# Altium schematic sheet interfaces_nucleo.SchDoc
size A3
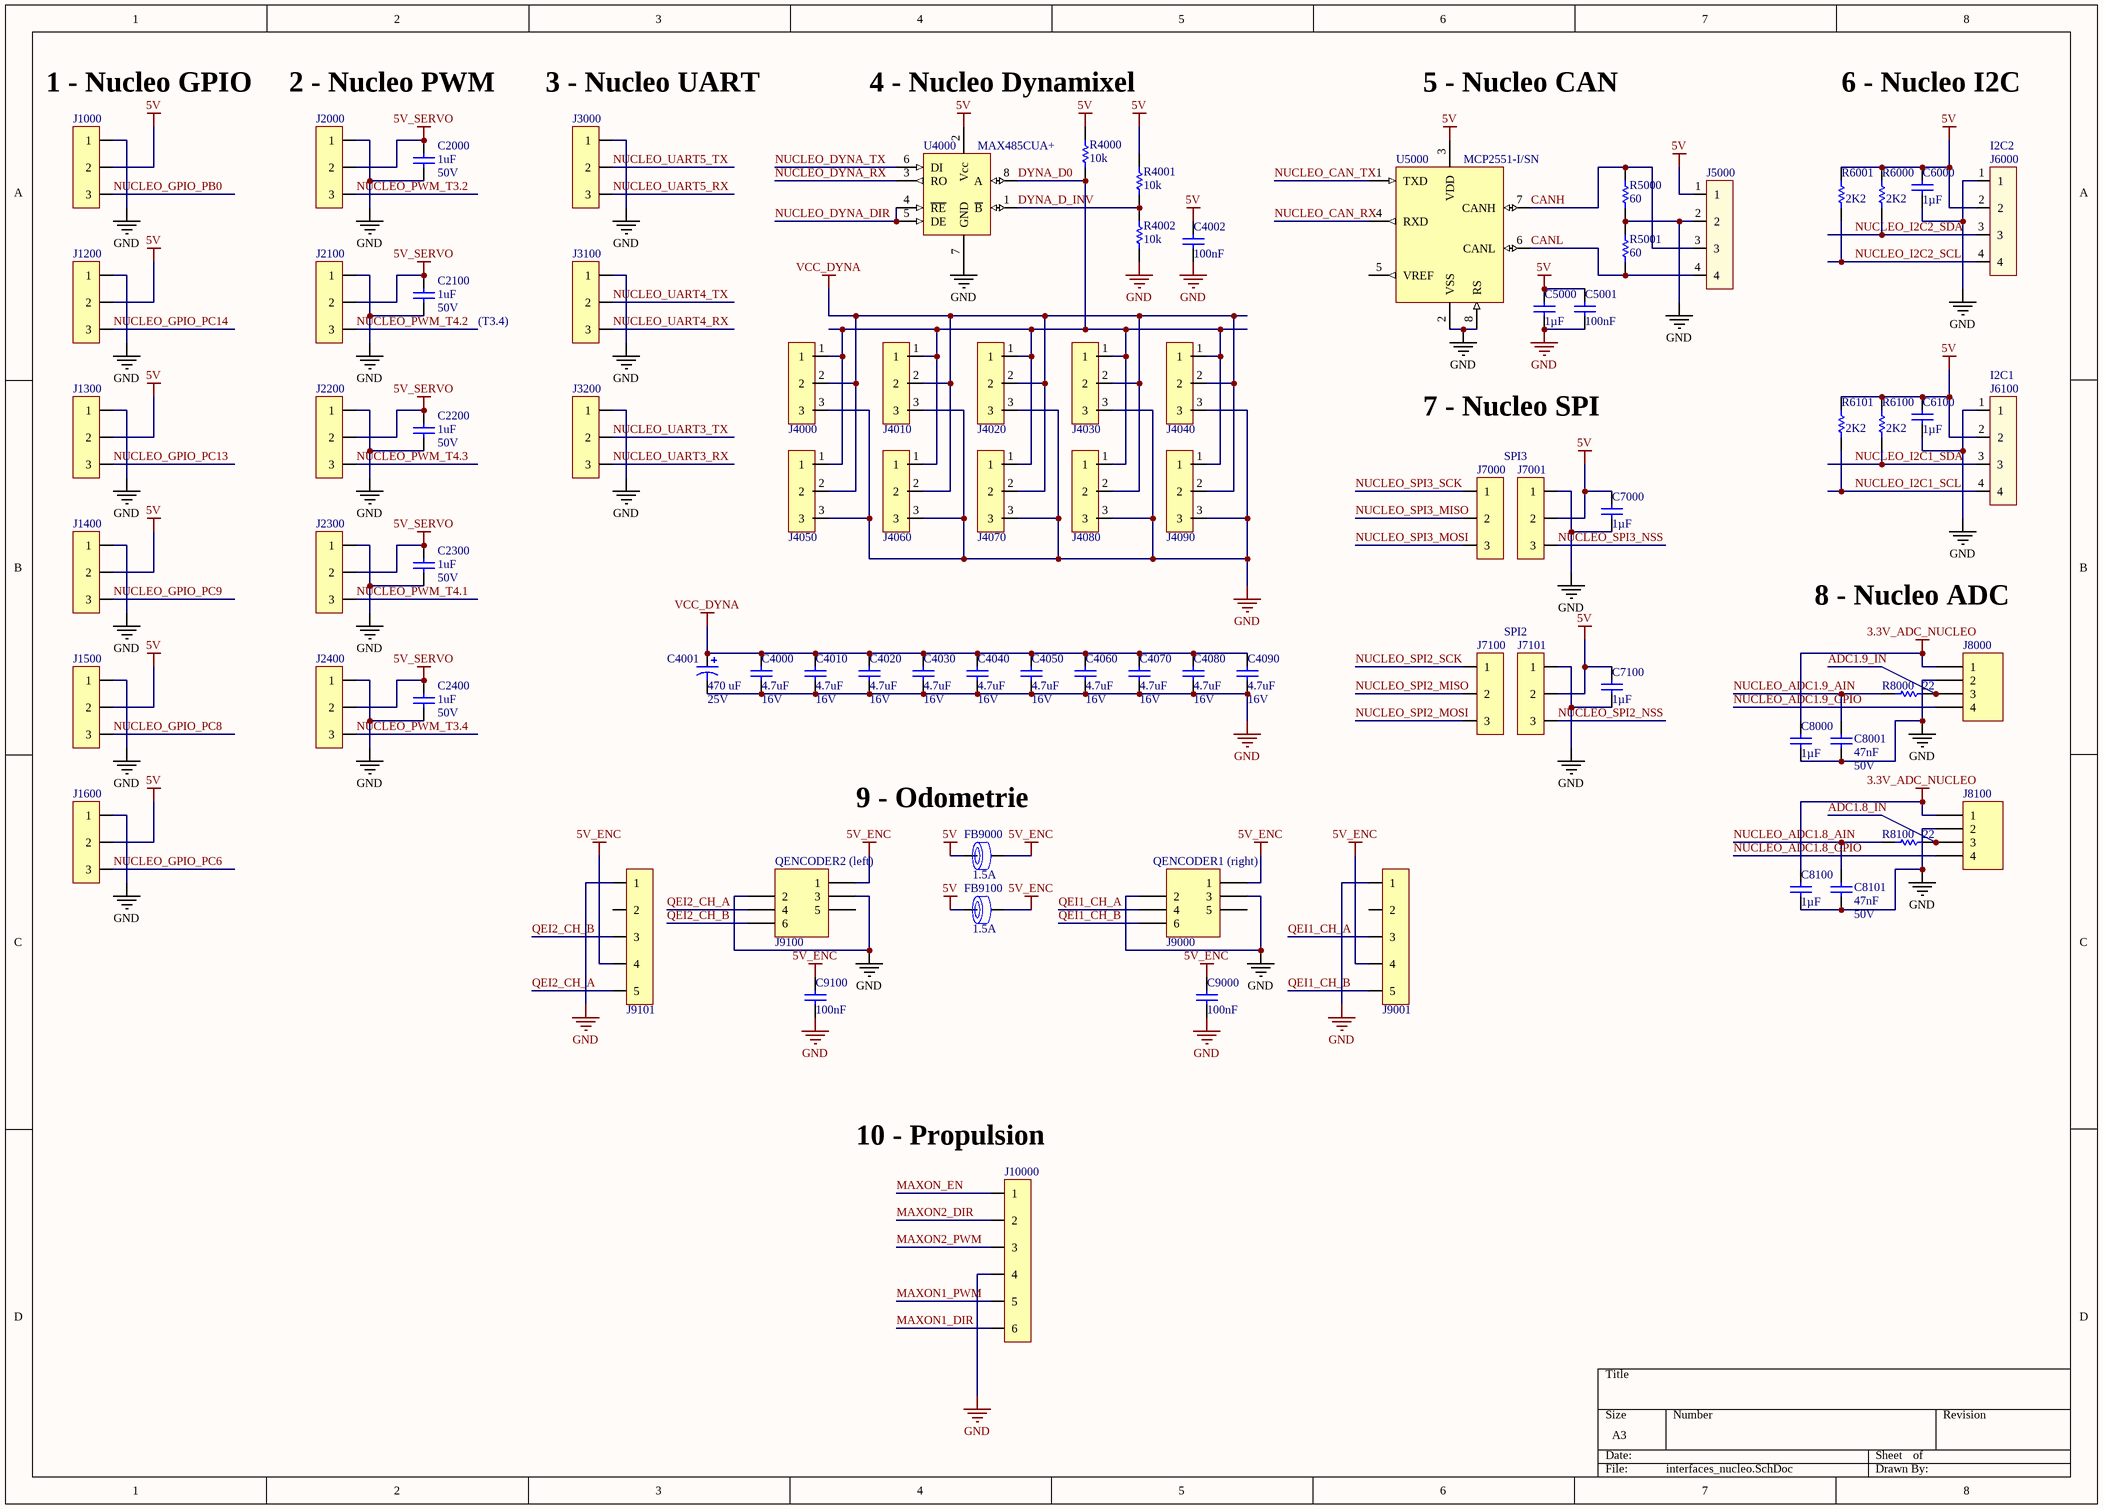
[diagram p0: interfaces_nucleo.SchDoc]

## Parts
C2000  1uF  RatedVoltage: 50V  [WCAP-CSGP_0805, 2x1.25x1.25]
C2100  1uF  RatedVoltage: 50V  [WCAP-CSGP_0805, 2x1.25x1.25]
C2200  1uF  RatedVoltage: 50V  [WCAP-CSGP_0805, 2x1.25x1.25]
C2300  1uF  RatedVoltage: 50V  [WCAP-CSGP_0805, 2x1.25x1.25]
C2400  1uF  RatedVoltage: 50V  [WCAP-CSGP_0805, 2x1.25x1.25]
C4000  4.7uF  RatedVoltage: 16V  [WCAP-CSGP_0805, 2x1.25x1.25]
C4001  470 uF  RatedVoltage: 25V  [WCAP-ATG8_8x11.5x3.5x0.5]
C4002  100nF  [WCAP-CSGP_0603, 1.6x0.8x0.8]
C4010  4.7uF  RatedVoltage: 16V  [WCAP-CSGP_0805, 2x1.25x1.25]
C4020  4.7uF  RatedVoltage: 16V  [WCAP-CSGP_0805, 2x1.25x1.25]
C4030  4.7uF  RatedVoltage: 16V  [WCAP-CSGP_0805, 2x1.25x1.25]
C4040  4.7uF  RatedVoltage: 16V  [WCAP-CSGP_0805, 2x1.25x1.25]
C4050  4.7uF  RatedVoltage: 16V  [WCAP-CSGP_0805, 2x1.25x1.25]
C4060  4.7uF  RatedVoltage: 16V  [WCAP-CSGP_0805, 2x1.25x1.25]
C4070  4.7uF  RatedVoltage: 16V  [WCAP-CSGP_0805, 2x1.25x1.25]
C4080  4.7uF  RatedVoltage: 16V  [WCAP-CSGP_0805, 2x1.25x1.25]
C4090  4.7uF  RatedVoltage: 16V  [WCAP-CSGP_0805, 2x1.25x1.25]
C5000  1µF  [WCAP-CSGP_0603, 1.6x0.8x0.8]
C5001  100nF  [WCAP-CSGP_0603, 1.6x0.8x0.8]
C6000  1µF  [WCAP-CSGP_0603, 1.6x0.8x0.8]
C6100  1µF  [WCAP-CSGP_0603, 1.6x0.8x0.8]
C7000  1µF  [WCAP-CSGP_0603, 1.6x0.8x0.8]
C7100  1µF  [WCAP-CSGP_0603, 1.6x0.8x0.8]
C8000  1µF  [WCAP-CSGP_0603, 1.6x0.8x0.8]
C8001  47nF  RatedVoltage: 50V  [WCAP-CSGP_0603, 1.6x0.8x0.8]
C8100  1µF  [WCAP-CSGP_0603, 1.6x0.8x0.8]
C8101  47nF  RatedVoltage: 50V  [WCAP-CSGP_0603, 1.6x0.8x0.8]
C9000  100nF  [WCAP-CSGP_0603, 1.6x0.8x0.8]
C9100  100nF  [WCAP-CSGP_0603, 1.6x0.8x0.8]
FB9000  RatedCurrent: 1.5A  [WE-CBF_0603_High Current]  (hidden comment: 742792624)
FB9100  RatedCurrent: 1.5A  [WE-CBF_0603_High Current]  (hidden comment: 742792624)
J1000  22-03-2031  [22-03-2031]  (value not drawn)
J1200  22-03-2031  [22-03-2031]  (value not drawn)
J1300  22-03-2031  [22-03-2031]  (value not drawn)
J1400  22-03-2031  [22-03-2031]  (value not drawn)
J1500  22-03-2031  [22-03-2031]  (value not drawn)
J1600  22-03-2031  [22-03-2031]  (value not drawn)
J2000  22-03-2031  [22-03-2031]  (value not drawn)
J2100  22-03-2031  [22-03-2031]  (value not drawn)
J2200  22-03-2031  [22-03-2031]  (value not drawn)
J2300  22-03-2031  [22-03-2031]  (value not drawn)
J2400  22-03-2031  [22-03-2031]  (value not drawn)
J3000  22-03-2031  [22-03-2031]  (value not drawn)
J3100  22-03-2031  [22-03-2031]  (value not drawn)
J3200  22-03-2031  [22-03-2031]  (value not drawn)
J4000  22-03-5035  [20-03-5035]  (value not drawn)
J4010  22-03-5035  [20-03-5035]  (value not drawn)
J4020  22-03-5035  [20-03-5035]  (value not drawn)
J4030  22-03-5035  [20-03-5035]  (value not drawn)
J4040  22-03-5035  [20-03-5035]  (value not drawn)
J4050  22-03-5035  [20-03-5035]  (value not drawn)
J4060  22-03-5035  [20-03-5035]  (value not drawn)
J4070  22-03-5035  [20-03-5035]  (value not drawn)
J4080  22-03-5035  [20-03-5035]  (value not drawn)
J4090  22-03-5035  [20-03-5035]  (value not drawn)
J5000  22-27-2041  [22-27-2041]  (value not drawn)
J6000  22-27-2041  [22-27-2041]  (value not drawn)
J6100  22-27-2041  [22-27-2041]  (value not drawn)
J7000  22-03-2031  [22-03-2031]  (value not drawn)
J7001  22-03-2031  [22-03-2031]  (value not drawn)
J7100  22-03-2031  [22-03-2031]  (value not drawn)
J7101  22-03-2031  [22-03-2031]  (value not drawn)
J8000  MC34645  [HDR1X4]  (value not drawn)
J8100  MC34645  [HDR1X4]  (value not drawn)
J9000  (no value)  [690367280676]
J9001  22-03-2051  [22-03-2051]  (value not drawn)
J9100  (no value)  [690367280676]
J9101  22-03-2051  [22-03-2051]  (value not drawn)
J10000  22-03-2061  [22-03-2061]  (value not drawn)
R4000  value 10k  [RESC1005X04N]  (hidden comment: RC0402FR-07100RL)
R4001  value 10k  [RESC1005X04N]  (hidden comment: RC0402FR-07100RL)
R4002  value 10k  [RESC1005X04N]  (hidden comment: RC0402FR-07100RL)
R5000  value 60  [RESC1005X04N]  (hidden comment: RC0402FR-07100RL)
R5001  value 60  [RESC1005X04N]  (hidden comment: RC0402FR-07100RL)
R6000  value 2K2  [RESC1005X04N]  (hidden comment: RC0402FR-07100RL)
R6001  value 2K2  [RESC1005X04N]  (hidden comment: RC0402FR-07100RL)
R6100  value 2K2  [RESC1005X04N]  (hidden comment: RC0402FR-07100RL)
R6101  value 2K2  [RESC1005X04N]  (hidden comment: RC0402FR-07100RL)
R8000  value 22  [RESC1005X04N]  (hidden comment: RC0402FR-0722RL)
R8100  value 22  [RESC1005X04N]  (hidden comment: RC0402FR-0722RL)
U4000  MAX485CUA+  [MMAX-8]
U5000  MCP2551-I/SN  [SO8_N]

## Nets
3.3V_ADC_NUCLEO: C8000.1 C8100.1 J8000.1 J8100.1
5V: C4002.1 C5000.1 C5001.1 C6000.1 C6100.1 C7000.1 C7100.1 FB9000.1 FB9100.1 J1000.2 J1200.2 J1300.2 J1400.2 J1500.2 J1600.2 J5000.1 J6000.2 J6100.2 J7001.2 J7101.2 R4000.2 R4001.2 R6000.2 R6001.2 R6100.2 R6101.2 U4000.2(Vcc) U5000.3(VDD)
5V_ENC: C9000.1 C9100.1 FB9000.2 FB9100.2 J9000.1 J9001.4 J9100.1 J9101.4
5V_SERVO: C2000.2 C2100.2 C2200.2 C2300.2 C2400.2 J2000.2 J2100.2 J2200.2 J2300.2 J2400.2
GND: C2000.1 C2100.1 C2200.1 C2300.1 C2400.1 C4000.1 C4001.2 C4002.2 C4010.1 C4020.1 C4030.1 C4040.1 C4050.1 C4060.1 C4070.1 C4080.1 C4090.1 C5000.2 C5001.2 C6000.2 C6100.2 C7000.2 C7100.2 C8000.2 C8001.1 C8100.2 C8101.1 C9000.2 C9100.2 J1000.1 J1200.1 J1300.1 J1400.1 J1500.1 J1600.1 J2000.1 J2100.1 J2200.1 J2300.1 J2400.1 J3000.1 J3100.1 J3200.1 J4000.3 J4010.3 J4020.3 J4030.3 J4040.3 J4050.3 J4060.3 J4070.3 J4080.3 J4090.3 J5000.2 J6000.1 J6100.1 J7001.1 J7101.1 J8000.2 J8100.2 J9000.2 J9000.3 J9001.1 J9100.2 J9100.3 J9101.1 J10000.4 R4002.1 R5000.1 R5001.2 U4000.7(GND) U5000.2(VSS) U5000.8(RS)
VCC_DYNA: C4000.2 C4001.1 C4010.2 C4020.2 C4030.2 C4040.2 C4050.2 C4060.2 C4070.2 C4080.2 C4090.2 J4000.2 J4010.2 J4020.2 J4030.2 J4040.2 J4050.2 J4060.2 J4070.2 J4080.2 J4090.2
ADC1.8_IN: J8100.3 R8100.2
ADC1.9_IN: J8000.3 R8000.2
CANH: J5000.3 R5000.2 U5000.7(CANH)
CANL: J5000.4 R5001.1 U5000.6(CANL)
DYNA_D0: J4000.1 J4010.1 J4020.1 J4030.1 J4040.1 J4050.1 J4060.1 J4070.1 J4080.1 J4090.1 R4000.1 U4000.8(A)
DYNA_D_INV: R4001.1 R4002.2 U4000.1(~{B})
MAXON1_DIR: J10000.6
MAXON1_PWM: J10000.5
MAXON2_DIR: J10000.2
MAXON2_PWM: J10000.3
MAXON_EN: J10000.1
NUCLEO_ADC1.8_AIN: C8101.2 R8100.1
NUCLEO_ADC1.8_GPIO: J8100.4
NUCLEO_ADC1.9_AIN: C8001.2 R8000.1
NUCLEO_ADC1.9_GPIO: J8000.4
NUCLEO_CAN_RX: U5000.4(RXD)
NUCLEO_CAN_TX: U5000.1(TXD)
NUCLEO_DYNA_DIR: U4000.4(~{RE}) U4000.5(DE)
NUCLEO_DYNA_RX: U4000.3(RO)
NUCLEO_DYNA_TX: U4000.6(DI)
NUCLEO_GPIO_PB0: J1000.3
NUCLEO_GPIO_PC6: J1600.3
NUCLEO_GPIO_PC8: J1500.3
NUCLEO_GPIO_PC9: J1400.3
NUCLEO_GPIO_PC13: J1300.3
NUCLEO_GPIO_PC14: J1200.3
NUCLEO_I2C1_SCL: J6100.4 R6101.1
NUCLEO_I2C1_SDA: J6100.3 R6100.1
NUCLEO_I2C2_SCL: J6000.4 R6001.1
NUCLEO_I2C2_SDA: J6000.3 R6000.1
NUCLEO_PWM_T3.2: J2000.3
NUCLEO_PWM_T3.4: J2400.3
NUCLEO_PWM_T4.1: J2300.3
NUCLEO_PWM_T4.2: J2100.3
NUCLEO_PWM_T4.3: J2200.3
NUCLEO_SPI2_MISO: J7100.2
NUCLEO_SPI2_MOSI: J7100.3
NUCLEO_SPI2_NSS: J7101.3
NUCLEO_SPI2_SCK: J7100.1
NUCLEO_SPI3_MISO: J7000.2
NUCLEO_SPI3_MOSI: J7000.3
NUCLEO_SPI3_NSS: J7001.3
NUCLEO_SPI3_SCK: J7000.1
NUCLEO_UART3_RX: J3200.3
NUCLEO_UART3_TX: J3200.2
NUCLEO_UART4_RX: J3100.3
NUCLEO_UART4_TX: J3100.2
NUCLEO_UART5_RX: J3000.3
NUCLEO_UART5_TX: J3000.2
QEI1_CH_A: J9000.4 J9001.3
QEI1_CH_B: J9000.6 J9001.5
QEI2_CH_A: J9100.4 J9101.5
QEI2_CH_B: J9100.6 J9101.3

Not connected (* = marked no-connect by the designer): J9000 5; J9001 2; J9100 5; J9101 2; U5000 5(VREF)

## Notes on the sheet
- (near J1000) 1 - Nucleo GPIO
- 2 - Nucleo PWM
- (near J3000) 3 - Nucleo UART
- 4 - Nucleo Dynamixel
- 5 - Nucleo CAN
- 6 - Nucleo I2C
- (near J6000) I2C2
- (T3.4)
- (near J6100) I2C1
- 7 - Nucleo SPI
- SPI3
- SPI2
- 8 - Nucleo ADC
- (near FB9000) 9 - Odometrie
- (near J9100) QENCODER2 (left)
- (near J9000) QENCODER1 (right)
- (near J10000) 10 - Propulsion

## Library data of the parts
C2000 C2100 C2200 C2300 C2400 = WCAP-CSGP, 885012207103: CAP CER 1uF 50V X7R 0805; Manufacturer: Wurth Elektronik; PublishedDate: Aug 2016; ComponentLink1Description: Manufacturer; ComponentLink1URL: http://www.we-online.de; ComponentLink2Description: Datasheet; ComponentLink2URL: http://katalog.we-online.com/pbs/datasheet/885012207103.pdf; Manufacturer Part Number: 885012207103; Value: 1uF; Size: 0805; CeramicType: X7R; ComponentClass: 2_NUCLEO_PWM
C4000 C4010 C4020 C4030 C4040 C4050 C4060 C4070 C4080 C4090 = WCAP-CSGP, 885012207053: CAP CER 4.7uF 16V X7R 0805; Manufacturer: Wurth Elektronik; PublishedDate: Aug 2016; ComponentLink1Description: Manufacturer; ComponentLink1URL: http://www.we-online.de; ComponentLink2Description: Datasheet; ComponentLink2URL: http://katalog.we-online.com/pbs/datasheet/885012207053.pdf; Manufacturer Part Number: 885012207053; Value: 4.7uF; Size: 0805; CeramicType: X7R; ComponentClass: 4_NUCLEO_DYNA
C4001 = WCAP-ATG8, 860010474013: CAP Alu 470 UF 20% 25 V; Manufacturer: Wurth Elektronik; PublishedDate: July 2016; ComponentLink1Description: Manufacturer; ComponentLink1URL: http://www.we-online.de; ComponentLink2Description: Datasheet; ComponentLink2URL: http://katalog.we-online.de/pbs/datasheet/860010474013.pdf; Manufacturer Part Number: 860010474013; Value: 470 uF; Size: 8mmx11.5mm; ComponentClass: 4_NUCLEO_DYNA
C4002 C5000 C5001 C6000 C6100 C7000 C7100 C8000 C8100 C9000 C9100 = WCAP-CSGP, 885012206095: CAP CER 100nF 50V X7R 0603; Manufacturer: Wurth Elektronik; PublishedDate: Aug 2016; ComponentLink1Description: Manufacturer; ComponentLink1URL: http://www.we-online.de; ComponentLink2Description: Datasheet; ComponentLink2URL: http://katalog.we-online.com/pbs/datasheet/885012206095.pdf; Manufacturer Part Number: 885012206095; Value: 100nF; Size: 0603; CeramicType: X7R; RatedVoltage: 50V
  C4002: ComponentClass: 4_NUCLEO_DYNA
  C5000 C5001: ComponentClass: 5_NUCLEO_CAN
  C6000 C6100: ComponentClass: 6_NUCLEO_I2C
  C7000 C7100: ComponentClass: 7_NUCLEO_SPI
  C8000 C8100: ComponentClass: 8_NUCLEO_ADC
  C9000 C9100: ComponentClass: 9_NUCLEO_ODO
C8001 C8101 = WCAP-CSGP, 885012206093: CAP CER 47nF 50V X7R 0603; Manufacturer: Wurth Elektronik; PublishedDate: Aug 2016; ComponentLink1Description: Manufacturer; ComponentLink1URL: http://www.we-online.de; ComponentLink2Description: Datasheet; ComponentLink2URL: http://katalog.we-online.com/pbs/datasheet/885012206093.pdf; Manufacturer Part Number: 885012206093; Value: 47nF; Size: 0603; CeramicType: X7R; ComponentClass: 8_NUCLEO_ADC
FB9000 FB9100 = WE-CBF, 742792624: Ferrite Bead 180ohm 0603 max1.5A; Manufacturer: Wurth Elektronik; Value: 180Ω; Type: High Current; PublishedDate: Aug 2016; ComponentLink1Description: Manufacturer; ComponentLink1URL: http://www.we-online.de; ComponentLink2Description: Datasheet; ComponentLink2URL: http://katalog.we-online.de/pbs/datasheet/742792624.pdf; Manufacturer Part Number: 742792624; Size: 0603; ComponentClass: 9_NUCLEO_ODO
J1000 J1200 J1300 J1400 J1500 J1600 J2000 J2100 J2200 J2300 J2400 J3000 J3100 J3200 J7000 J7001 J7100 J7101 = 22-03-2031: Manufacturer 1: MOLEX; Supplier 1: Farnell; Supplier Part Number 1: 9731083; Manufacturer Part Number: 22-03-2031; Pricing: 10=0.27, 100=0.242, 200=0.22, 500=0.208, 1000=0.202, 2500=0.196 (EUR); ComponentLink1URL: http://www.farnell.com/cad/1533907.pdf; ComponentLink1Description: http://www.farnell.com/cad/1533907.pdf; ComponentLink2URL: http://www.farnell.com/datasheets/1785732.pdf; ComponentLink2Description: http://www.farnell.com/datasheets/1785732.pdf
  J1000 J1200 J1300 J1400 J1500 J1600: ComponentClass: 1_NUCLEO_GPIO
  J2000 J2100 J2200 J2300 J2400: ComponentClass: 2_NUCLEO_PWM
  J3000 J3100 J3200: ComponentClass: 3_NUCLEO_UART
  J7000 J7001 J7100 J7101: ComponentClass: 7_NUCLEO_SPI
J4000 J4010 J4020 J4030 J4040 J4050 J4060 J4070 J4080 J4090 = 20-03-5035: Manufacturer 1: MOLEX; Supplier 1: Farnell; Supplier Part Number 1: 9979620; Manufacturer Part Number: 22-03-5035; Pricing: 10=0.153, 100=0.144, 250=0.118, 500=0.091, 1000=0.059, 2500=0.057, 2500=0.0441, 30000=0.0397 (EUR); ComponentLink1URL: http://www.farnell.com/cad/495071.pdf; ComponentLink1Description: http://www.farnell.com/cad/495071.pdf; ComponentLink2URL: http://www.farnell.com/datasheets/1801024.pdf; ComponentLink2Description: http://www.farnell.com/datasheets/1801024.pdf; ComponentLink3Description: http://fr.farnell.com/jsp/level5/module.jsp?moduleId=fr/418942.xml; ComponentLink3URL: http://fr.farnell.com/jsp/level5/module.jsp?moduleId=fr/418942.xml; ComponentClass: 4_NUCLEO_DYNA
J5000 J6000 J6100 = 22-27-2041: Manufacturer 1: MOLEX; Manufacturer Part Number: 22-27-2041..; Supplier 1: Farnell; Supplier Part Number 1: 9731164; Pricing: 10=0.28, 100=0.24, 200=0.22, 500=0.199, 1000=0.175, 2500=0.128, 2500=0.0898, 30000=0.0812 (EUR); ComponentLink1URL: http://www.farnell.com/cad/1595526.pdf; ComponentLink1Description: http://www.farnell.com/cad/1595526.pdf; ComponentLink2URL: http://www.farnell.com/datasheets/1803079.pdf; ComponentLink2Description: http://www.farnell.com/datasheets/1803079.pdf
  J5000: ComponentClass: 5_NUCLEO_CAN
  J6000 J6100: ComponentClass: 6_NUCLEO_I2C
J8000 J8100 = MC34645: MULTICOMP - MC34645 - EMB. MALE COUDEE  CON. MALE 2.54MM 4VOIE; Supplier 1: Farnell; Manufacturer: MULTICOMP; Manufacturer Part Number: MC34645; ComponentLink1URL: http://www.farnell.com/datasheets/1751312.pdf; ComponentLink1Description: http://www.farnell.com/datasheets/1751312.pdf; Pricing: 1=0.597, 5=0.531, 25=0.465, 50=0.399, 100=0.334, 250=0.138 (EUR); Supplier Part Number 1: 1675775; ComponentClass: 8_NUCLEO_ADC
J9000 J9100 = 690367280676: WR-MM Female SMT Connector with Polarization; Manufacturer 1: W¨¹rth Elektronik eiSos GmbH; ComponentLink1 Description: Manufacturer; ComponentLink2 Description: Datasheet; Value: 6; ComponentLink1URL: http://www.we-online.com; ComponentLink2URL: http://katalog.we-online.de/em/datasheet/69036728xx76.pdf; Manufacturer Part Number: 690367280676; Supplier 1: Farnell; Supplier Part Number 1: 1641849; ComponentClass: 9_NUCLEO_ODO
J9001 J9101 = 22-03-2051: Manufacturer 1: MOLEX; Supplier 1: Farnell; Supplier Part Number 1: 9731105; Manufacturer Part Number: 22-03-2051; Pricing: 10=0.43, 100=0.35, 200=0.29, 500=0.26, 1000=0.24, 2500=0.191, 2500=0.172, 20000=0.155 (EUR); ComponentLink1URL: http://www.farnell.com/cad/1533907.pdf; ComponentLink1Description: http://www.farnell.com/cad/1533907.pdf; ComponentLink2URL: http://www.farnell.com/datasheets/1803075.pdf; ComponentLink2Description: http://www.farnell.com/datasheets/1803075.pdf; ComponentClass: 9_NUCLEO_ODO
J10000 = 22-03-2061: Manufacturer 1: MOLEX; Supplier 1: Farnell; Supplier Part Number 1: 9731113; Manufacturer Part Number: 22-03-2061; Pricing: 10=0.76, 100=0.7, 200=0.64, 500=0.49, 1000=0.43, 2500=0.31, 2500=0.304, 20000=0.298 (EUR); ComponentLink1URL: http://www.farnell.com/cad/1533907.pdf; ComponentLink1Description: http://www.farnell.com/cad/1533907.pdf; ComponentLink2URL: http://www.farnell.com/datasheets/1791310.pdf; ComponentLink2Description: http://www.farnell.com/datasheets/1791310.pdf; ComponentClass: 10_NUCLEO_PROP
R4000-R4002 R5000 R5001 R6000 R6001 R6100 R6101 = RC0402FR-07100RL: RES SMD 100 OHM 1% 1/16W 0402; Manufacturer: Yageo; Power: 63mW; Vmax: 50V; Type: Thick Film; ComponentLink1Description: Manufacturer; ComponentLink1URL: http://www.yageo.com/NewPortal/_en/index.jsp; ComponentLink2Description: Datasheet; ComponentLink2URL: http://www.farnell.com/datasheets/2167052.pdf; Manufacturer Part Number: RC0402FR-07100RL; Supplier 1: Farnell; Supplier Part Number 1: 9239111; Precision: ±1%
  R4000-R4002: ComponentClass: 4_NUCLEO_DYNA
  R5000 R5001: ComponentClass: 5_NUCLEO_CAN
  R6000 R6001 R6100 R6101: ComponentClass: 6_NUCLEO_I2C
R8000 R8100 = RC0402FR-0722RL: RES SMD 22 OHM 1% 1/16W 0402; Manufacturer: Yageo; Power: 63mW; Vmax: 50V; Type: Thick Film; ComponentLink1Description: Manufacturer; ComponentLink1URL: http://www.yageo.com/NewPortal/_en/index.jsp; ComponentLink2Description: Datasheet; ComponentLink2URL: http://www.farnell.com/datasheets/2167052.pdf; Manufacturer Part Number: RC0402FR-0722RL; Supplier 1: Farnell; Supplier Part Number 1: 9239030; Precision: ±1%; ComponentClass: 8_NUCLEO_ADC
U4000 = MAX485CUA+: IC TXRX RS485/RS422 8-UMAX; Manufacturer: Maxim Integrated; Manufacturer Part Number: MAX485CUA+; ComponentLink1URL: http://datasheets.maximintegrated.com/en/ds/MAX1487-MAX491.pdf; ComponentLink1Description: http://datasheets.maximintegrated.com/en/ds/MAX1487-MAX491.pdf; Supplier 1: Farnell; Supplier Part Number 1: 2511735; ComponentClass: 4_NUCLEO_DYNA
U5000 = MCP2551-I/SN: IC TRANSCEIVER CAN HI-SPD 8-SOIC; Manufacturer: Microchip Technology; Manufacturer Part Number: MCP2551-I/SN; ComponentLink1Description: Datasheet; ComponentLink1URL: http://www.farnell.com/datasheets/657417.pdf; Supplier 1: Farnell; Supplier Part Number 1: 9758569; ComponentClass: 5_NUCLEO_CAN